# Altium schematic sheet NRF24L01_SPI.SchDoc
size A4
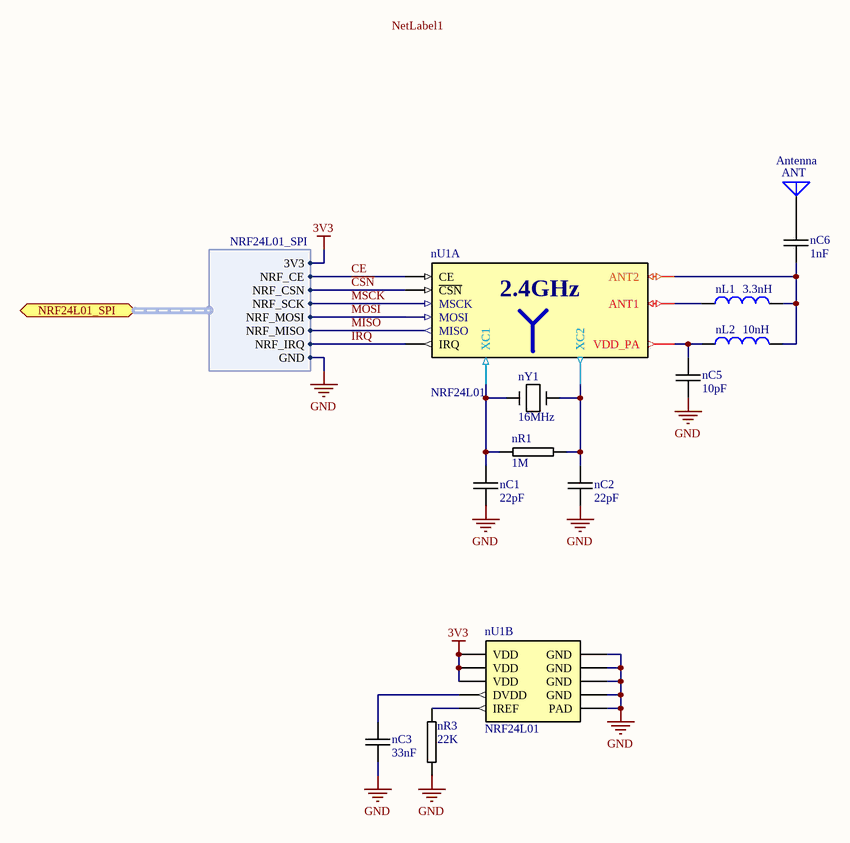
[diagram p0: NRF24L01_SPI.SchDoc]

## Parts
ANT  Antenna  [PIN1]
nC1  22pF  [0603C-GENERIC]
nC2  22pF  [0603C-GENERIC]
nC3  33nF  [0603C-GENERIC]
nC5  10pF  [0603C-GENERIC]
nC6  1nF  [0603C-GENERIC]
nL1  Inductance: 3.3nH  [C_0603]  (hidden comment: IND)
nL2  Inductance: 10nH  [C_0603]  (hidden comment: IND)
nR1  1M  [0603R-GENERIC]
nR3  22K  [0603R-22K]
nU1  NRF24L01  [QFN20]  (parts A,B of 2)
nY1  16MHz  [3225]

## Ports
NRF24L01_SPI (harness NRF24L01_SPI)

## Harnesses
NRF24L01_SPI: NRF_CE, NRF_CSN, NRF_SCK, NRF_MOSI, NRF_MISO, NRF_IRQ, 3V3, GND

## Nets
3V3: nU1.7(VDD) nU1.15(VDD) nU1.18(VDD) ; port NRF24L01_SPI.3V3
GND: nC1.2 nC2.2 nC3.1 nC5.1 nR3.2 nU1.8(GND) nU1.14(GND) nU1.17(GND) nU1.20(GND) nU1.21(PAD) nY1.2 nY1.4 ; port NRF24L01_SPI.GND
~{CSN}: nU1.2(~{CSN}) ; port NRF24L01_SPI.NRF_CSN
CE: nU1.1(CE) ; port NRF24L01_SPI.NRF_CE
IRQ: nU1.6(IRQ) ; port NRF24L01_SPI.NRF_IRQ
MISO: nU1.5(MISO) ; port NRF24L01_SPI.NRF_MISO
MOSI: nU1.4(MOSI) ; port NRF24L01_SPI.NRF_MOSI
MSCK: nU1.3(MSCK) ; port NRF24L01_SPI.NRF_SCK
NetANT_1: ANT.1(A) nC6.1
NetnC1_1: nC1.1 nR1.1 nU1.10(XC1) nY1.1
NetnC2_1: nC2.1 nR1.2 nU1.9(XC2) nY1.3
NetnC3_2: nC3.2 nU1.19(DVDD)
NetnC5_2: nC5.2 nL2.1 nU1.11(VDD_PA)
NetnC6_2: nC6.2 nL1.2 nL2.2 nU1.13(ANT2)
NetnL1_1: nL1.1 nU1.12(ANT1)
NetnR3_1: nR3.1 nU1.16(IREF)

## Notes on the sheet
- Labels drawn without touching a wire or pin: NetLabel1
- (in symbol NRF24L01, part A) 2.4GHz

## Library data of the parts
ANT = Antenna: Generic Antenna; Published: 24-Mar-1999; LatestRevisionDate: 17-Jul-2002; LatestRevisionNote: Re-released for DXP Platform.; PackageReference: PIN1; Publisher: Altium Limited
nC1 nC2 = 0603C-22PF-50V-C0G-PAN: CAPACITOR 0603 CERAMIC; Manufacturer Part Number: ECJ-1VC1H220J; Manufacturer: Panasonic - ECG; Reel: C10; Tolerance: ±5%; Temperature Coefficient: C0G, NP0; Voltage - Rated: 50V; Supplier 1: Digi-Key; Features: General Purpose; Lead Spacing: -; Supplier: Digi-Key; Capacitance: 22pF; Packaging: Tape & Reel (TR); Mounting Type: Surface Mount, MLCC; RoHS: RoHS Compliant; Operating Temperature: -55°C ~ 125°C; Thickness: 0.80mm; Package / Case: 0603 (1608 metric); Category: Capacitors; Supplier Part Number 1: PCC220ACVTR-ND; Supplier Part Number: PCC220ACVTR-ND
nC3 nC5 = 0603C-33PF-50V-C0G-PAN: CAPACITOR 0603 CERAMIC; Reel: C42
nC6 = 0603C-1NF-50V-X7R: CAPACITOR 0603 CERAMIC
nL1 nL2 = Inductor
nR1 = 0603R-1M: GENERIC RESISTOR 0603; Manufacturer: Stackpole Electronics Inc; Manufacturer Part Number: RMCF 1/16 1M 1% R; Power (Watts): 0.1W, 1/10W; Temperature Coefficient: ±100ppm/°C; Resistance In Ohms: 1.00M; Tolerance: ±1%; REEL: R51; Supplier: Digi-Key; Supplier Part Number: RMCF1/161MFRTR-ND; Category: Resistors; Lead Style: Surface Mount (SMD - SMT); Case: 0603 (1608 metric); RoHS: RoHS Compliant; Composition: Thick Film; Packaging: Tape & Reel (TR); Supplier 1: Digi-Key; Supplier Part Number 1: RMCF0603FT1M00TR-ND
nR3 = 0603R-22K: GENERIC RESISTOR 0603; Manufacturer: Stackpole Electronics Inc; Manufacturer Part Number: RMC 1/16 22K 1% R; Tolerance: ±1%; Resistance In Ohms: 22.0K; Power (Watts): 0.1W, 1/10W; Temperature Coefficient: ±100ppm/°C; Supplier 1: Digi-Key; Supplier Part Number 1: RMC1/1622KFR-ND; Category: Resistors; Case: 0603 (1608 metric); RoHS: RoHS Compliant; Supplier Part Number: RMC1/1622KFR-ND; Packaging: Tape & Reel (TR); Supplier: Digi-Key; Composition: Thick Film; Lead Style: Surface Mount (SMD - SMT)
nU1 = NRF24L01: 2.4GHz WIRELESS TRANSIVER
nY1 = 3225 CRYSTAL